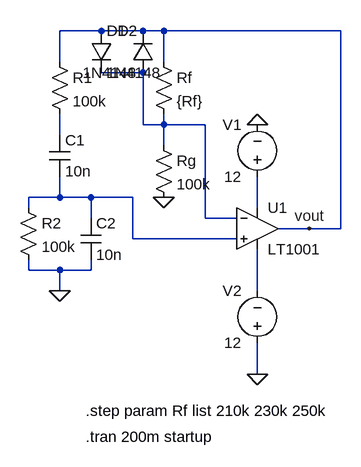
[diagram p0: schematic Q2.asc]
Q2.asc, the LTspice schematic file:
Version 4
SHEET 1 880 744
WIRE 416 32 352 32
WIRE 480 32 416 32
WIRE 512 32 480 32
WIRE 784 32 512 32
WIRE 352 80 352 32
WIRE 512 80 512 32
WIRE 480 96 416 96
WIRE 480 176 480 96
WIRE 512 176 512 160
WIRE 512 176 480 176
WIRE 576 176 512 176
WIRE 352 192 352 160
WIRE 512 208 512 176
WIRE 352 288 352 256
WIRE 352 288 304 288
WIRE 400 288 352 288
WIRE 464 288 400 288
WIRE 304 304 304 288
WIRE 656 304 656 256
WIRE 400 320 400 288
WIRE 576 320 576 176
WIRE 624 320 576 320
WIRE 736 336 688 336
WIRE 784 336 784 32
WIRE 784 336 736 336
WIRE 464 352 464 288
WIRE 624 352 464 352
WIRE 304 400 304 384
WIRE 352 400 304 400
WIRE 400 400 400 384
WIRE 400 400 352 400
WIRE 352 432 352 400
WIRE 656 432 656 368
WIRE 656 560 656 512
FLAG 352 432 0
FLAG 656 176 0
FLAG 512 288 0
FLAG 736 336 vout
FLAG 656 560 0
SYMBOL Res 288 288 R0
SYMATTR InstName R2
SYMATTR Value 100k
SYMBOL Cap 384 320 R0
SYMATTR InstName C2
SYMATTR Value 10n
SYMBOL Cap 336 192 R0
SYMATTR InstName C1
SYMATTR Value 10n
SYMBOL Res 336 64 R0
SYMATTR InstName R1
SYMATTR Value 100k
SYMBOL OpAmps/LT1001 656 272 R0
SYMATTR InstName U1
SYMBOL Voltage 656 272 R180
WINDOW 0 24 96 Left 2
WINDOW 3 24 16 Left 2
SYMATTR InstName V1
SYMATTR Value 12
SYMBOL Voltage 656 528 R180
WINDOW 0 24 96 Left 2
WINDOW 3 24 16 Left 2
SYMATTR InstName V2
SYMATTR Value 12
SYMBOL Res 496 64 R0
SYMATTR InstName Rf
SYMATTR Value {Rf}
SYMBOL Res 496 192 R0
SYMATTR InstName Rg
SYMATTR Value 100k
SYMBOL diode 400 32 R0
SYMATTR InstName D1
SYMATTR Value 1N4148
SYMBOL diode 496 96 R180
WINDOW 0 24 64 Left 2
WINDOW 3 24 0 Left 2
SYMATTR InstName D2
SYMATTR Value 1N4148
TEXT 392 616 Left 2 !.step param Rf list 210k 230k 250k
TEXT 392 656 Left 2 !.tran 200m startup

The netlist it stands for:
* Q2.asc
R2 N003 0 100k
C2 N003 0 10n
C1 N002 N003 10n
R1 vout N002 100k
XU1 N003 N001 N004 N005 vout LT1001  ; pins In+ In- V+ V- OUT
V1 N004 0 12
V2 0 N005 12
Rf vout N001 {Rf}
Rg N001 0 100k
D1 vout N001 1N4148
D2 N001 vout 1N4148
.model D D
.lib standard.dio
.step param Rf list 210k 230k 250k
.tran 200m startup
.lib LTC.lib
.backanno
.end